# Altium schematic sheet Bridges.SchDoc
size A3
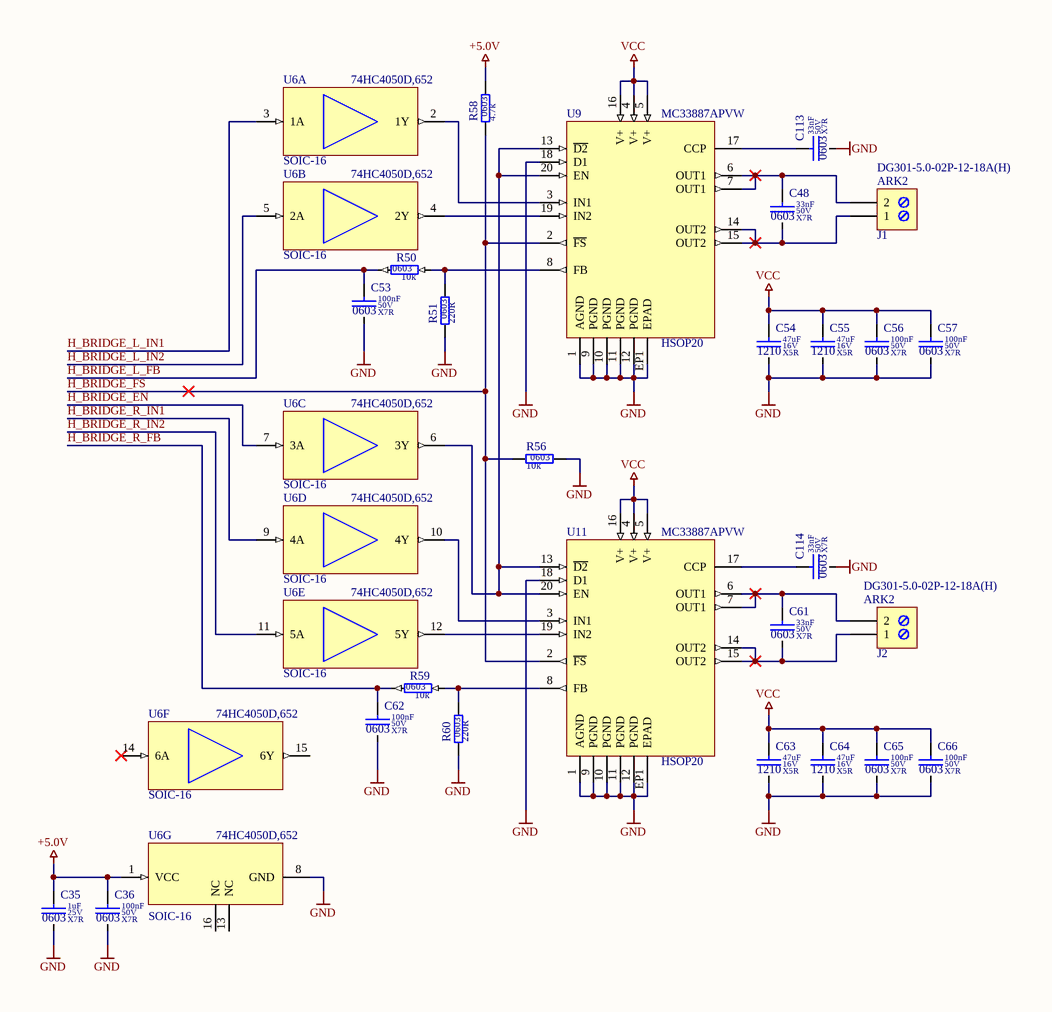
[diagram p0: Bridges.SchDoc]

## Parts
C35  value 1uF  Dielectric: X7R  Voltage: 25V  SCH_Footprint: 0603  [C_0603_1608]  (hidden comment: Ceramic X7R)
C36  value 100nF  Dielectric: X7R  Voltage: 50V  SCH_Footprint: 0603  [C_0603_1608]  (hidden comment: Ceramic X7R)
C48  value 33nF  Dielectric: X7R  Voltage: 50V  SCH_Footprint: 0603  [C_0603_1608]  (hidden comment: Ceramic X7R)
C53  value 100nF  Dielectric: X7R  Voltage: 50V  SCH_Footprint: 0603  [C_0603_1608]  (hidden comment: Ceramic X7R)
C54  value 47uF  Dielectric: X5R  Voltage: 16V  SCH_Footprint: 1210  [C_1210_3225]  (hidden comment: Ceramic X5R)
C55  value 47uF  Dielectric: X5R  Voltage: 16V  SCH_Footprint: 1210  [C_1210_3225]  (hidden comment: Ceramic X5R)
C56  value 100nF  Dielectric: X7R  Voltage: 50V  SCH_Footprint: 0603  [C_0603_1608]  (hidden comment: Ceramic X7R)
C57  value 100nF  Dielectric: X7R  Voltage: 50V  SCH_Footprint: 0603  [C_0603_1608]  (hidden comment: Ceramic X7R)
C61  value 33nF  Dielectric: X7R  Voltage: 50V  SCH_Footprint: 0603  [C_0603_1608]  (hidden comment: Ceramic X7R)
C62  value 100nF  Dielectric: X7R  Voltage: 50V  SCH_Footprint: 0603  [C_0603_1608]  (hidden comment: Ceramic X7R)
C63  value 47uF  Dielectric: X5R  Voltage: 16V  SCH_Footprint: 1210  [C_1210_3225]  (hidden comment: Ceramic X5R)
C64  value 47uF  Dielectric: X5R  Voltage: 16V  SCH_Footprint: 1210  [C_1210_3225]  (hidden comment: Ceramic X5R)
C65  value 100nF  Dielectric: X7R  Voltage: 50V  SCH_Footprint: 0603  [C_0603_1608]  (hidden comment: Ceramic X7R)
C66  value 100nF  Dielectric: X7R  Voltage: 50V  SCH_Footprint: 0603  [C_0603_1608]  (hidden comment: Ceramic X7R)
C113  value 33nF  Dielectric: X7R  Voltage: 50V  SCH_Footprint: 0603  [C_0603_1608]  (hidden comment: Ceramic X7R)
C114  value 33nF  Dielectric: X7R  Voltage: 50V  SCH_Footprint: 0603  [C_0603_1608]  (hidden comment: Ceramic X7R)
J1  value DG301-5.0-02P-12-18A(H)  [J_ARK2]  (hidden comment: ARK2)
J2  value DG301-5.0-02P-12-18A(H)  [J_ARK2]  (hidden comment: ARK2)
R50  value 10k  SCH_Footprint: 0603  [R_0603_1608]  (hidden comment: Resistor)
R51  value 220R  SCH_Footprint: 0603  [R_0603_1608]  (hidden comment: Resistor)
R56  value 10k  SCH_Footprint: 0603  [R_0603_1608]  (hidden comment: Resistor)
R58  value 4.7k  SCH_Footprint: 0603  [R_0603_1608]  (hidden comment: Resistor)
R59  value 10k  SCH_Footprint: 0603  [R_0603_1608]  (hidden comment: Resistor)
R60  value 220R  SCH_Footprint: 0603  [R_0603_1608]  (hidden comment: Resistor)
U6  SCH_Footprint: SOIC-16  [SOP16_SO16_SOIC16_4X10X18]  (hidden comment: 74HC4050D,652)  (parts A,B,C,D,E,F,G of 7)
U9  value MC33887APVW  SCH_Footprint: HSOP20  [HSOP20_16x11]  (hidden comment: MC33887)
U11  value MC33887APVW  SCH_Footprint: HSOP20  [HSOP20_16x11]  (hidden comment: MC33887)

## Nets
+5.0V: C35.1 C36.1 R58.2 U6.1(VCC)
GND: C35.2 C36.2 C53.2 C54.2 C55.2 C56.2 C57.2 C62.2 C63.2 C64.2 C65.2 C66.2 C113.2 C114.2 R51.1 R56.2 R60.1 U6.8(GND) U9.1(AGND) U9.9(PGND) U9.10(PGND) U9.11(PGND) U9.12(PGND) U9.18(D1) U9.EP1(EPAD) U11.1(AGND) U11.9(PGND) U11.10(PGND) U11.11(PGND) U11.12(PGND) U11.18(D1) U11.EP1(EPAD)
VCC: C54.1 C55.1 C56.1 C57.1 C63.1 C64.1 C65.1 C66.1 U9.4(V+) U9.5(V+) U9.16(V+) U11.4(V+) U11.5(V+) U11.16(V+)
H_BRIDGE_EN: U6.7(3A)
H_BRIDGE_FS: R56.1 R58.1 U9.2(~{FS}) U11.2(~{FS})
H_BRIDGE_L_FB: C53.1 R50.2
H_BRIDGE_L_IN1: U6.3(1A)
H_BRIDGE_L_IN2: U6.5(2A)
H_BRIDGE_R_FB: C62.1 R59.2
H_BRIDGE_R_IN1: U6.9(4A)
H_BRIDGE_R_IN2: U6.11(5A)
NetC48_1: C48.1 J1.2 U9.6(OUT1) U9.7(OUT1)
NetC48_2: C48.2 J1.1 U9.14(OUT2) U9.15(OUT2)
NetC61_1: C61.1 J2.2 U11.6(OUT1) U11.7(OUT1)
NetC61_2: C61.2 J2.1 U11.14(OUT2) U11.15(OUT2)
NetC113_1: C113.1 U9.17(CCP)
NetC114_1: C114.1 U11.17(CCP)
NetR50_1: R50.1 R51.2 U9.8(FB)
NetR59_1: R59.1 R60.2 U11.8(FB)
NetU6_2: U6.2(1Y) U9.3(IN1)
NetU6_4: U6.4(2Y) U9.19(IN2)
NetU6_6: U6.6(3Y) U9.13(~{D2}) U9.20(EN) U11.13(~{D2}) U11.20(EN)
NetU6_10: U6.10(4Y) U11.3(IN1)
NetU6_12: U6.12(5Y) U11.19(IN2)

Not connected (* = marked no-connect by the designer): U6 13(NC) 14(6A)* 15(6Y) 16(NC)

## Notes on the sheet
- Title
- Size:
- Date:
- A3
- Number:
- Time:
- Revision:
- Sheet
- of
- File:

## Library data of the parts
C35 = C_1uF_25V_X7R_0603_10: Capacitor; Manufacturer: Samsung; Manufacturer Part Number: CL10B105KA8NNNC; Tolerance (%): 10; Part Number: C_1uF_25V_X7R_0603_10; HelpURL: http://www.tme.eu/pl/Document/4a42202b32dab16128fe107dd69598cc/samsung-chip-cap.pdf; Supplier 1: TME; Supplier Part Number 1: CL10B105KA8NNNC; Supplier 2: RS Components; Supplier 3: Farnell; Supplier 4: Mouser; Supplier 5: Digi-Key
C36 C53 C56 C57 C62 C65 C66 = C_100nF_50V_X7R_0603_5: Capacitor; Manufacturer: Samsung; Manufacturer Part Number: CL10B104JB8NNNC; Tolerance (%): 5; Part Number: C_100nF_50V_X7R_0603_5; HelpURL: http://www.tme.eu/pl/Document/4a42202b32dab16128fe107dd69598cc/samsung-chip-cap.pdf; Supplier 1: TME; Supplier Part Number 1: CL10B104JB8NNNC; Supplier 2: RS Components; Supplier 3: Farnell; Supplier 4: Mouser; Supplier 5: Digi-Key
C48 C61 C113 C114 = C_33nF_50V_X7R_0603_10: Capacitor; Manufacturer: Yageo; Manufacturer Part Number: CC0603KRX7R9BB333; Tolerance (%): 10; Part Number: C_33nF_50V_X7R_0603_10; HelpURL: https://datasheet.octopart.com/CC0603KRX7R9BB333-Yageo-datasheet-10883670.pdf; Supplier 1: TME; Supplier 2: RS Components; Supplier 3: Farnell; Supplier 4: Mouser; Supplier 5: Digi-Key
C54 C55 C63 C64 = C_47uF_16V_X5R_1210_10: Capacitor; Manufacturer: Samsung; Manufacturer Part Number: CL32A476KOJNNNE; Tolerance (%): 10; Part Number: C_47uF_16V_X5R_1210_10; HelpURL: http://www.samsungsem.com/kr/support/product-search/mlcc/__icsFiles/afieldfile/2018/06/21/CL32A476KOJNNNE.pdf; Supplier 1: TME; Supplier 2: RS Components; Supplier 3: Farnell; Supplier 4: Mouser; Supplier 5: Digi-Key; Supplier Part Number 5: 1276-3376-1-ND
J1 J2 = J_TB-5.0-P-2P: ARK Screw terminal, 2-Pin; Manufacturer: DEGSON ELECTRONICS; SCH_Footprint: ARK2; Part Number: J_TB-5.0-P-2P; Component Type: Standard; HelpURL: https://datasheet.octopart.com/DG301-5.0-03P-12-18A%28H%29-Degson-datasheet-17801202.pdf; Manufacturer Part Number: DG301-5.0-02P-12-18A(H); Supplier 1: TME; Supplier Part Number 1: DG301-5.0-2/6B; Supplier 2: RS Components; Supplier 3: Farnell; Supplier 4: Mouser; Supplier 5: Digi-Key
R50 R56 R59 = R_10k_0603_1: Manufacturer: Vishay; Manufacturer Part Number: CRCW060310K0FKTABC; Voltage: 75V; Power: 100mW; Tolerance: 1%; Part Number: R_10k_0603_1; HelpURL: http://www.tme.eu/pl/Document/622e28308c06d160637f2b14751ba16b/Data%20Sheet%20CRCW_BCe3.pdf; Supplier 1: TME; Supplier Part Number 1: CRCW060310K0FKTABC; Supplier 2: RS Components; Supplier 3: Farnell; Supplier 4: Mouser; Supplier Part Number 4: 667-ERJ-3EKF1002V; Supplier 5: Digi-Key; Supplier Part Number 5: P10KGCT-ND
R51 R60 = R_220R_0603_1: Manufacturer: Royalohm; Manufacturer Part Number: 0603SAF2200T5E; Voltage: 50V; Power: 100mW; Tolerance: 1%; Part Number: R_220R_0603_1; HelpURL: http://www.tme.eu/pl/Document/b315665a56acbc42df513c99b390ad98/ROYALOHM-THICKFILM.pdf; Supplier 1: TME; Supplier Part Number 1: SMD0603-220R-1%; Supplier 2: RS Components; Supplier 3: Farnell; Supplier 4: Mouser; Supplier 5: Digi-Key
R58 = R_4.7k_0603_1: Manufacturer: Yageo; Manufacturer Part Number: RC0603FR-074K7L; Voltage: 75V; Power: 100mW; Tolerance: 1%; Part Number: R_4.7k_0603_1; HelpURL: http://www.farnell.com/datasheets/2167052.pdf?_ga=2.156163131.1690599162.1548417389-1379097396.1542296996&_gac=1.18389067.1547230258.Cj0KCQiAmuHhBRD0ARIsAFWyPwhX8HcvXnM3tA0ZBodZLzDIjH2ZxLpjT5LWo9bad_HPRbU8LfPq44UaAhEwEALw_wcB; Supplier 1: TME; Supplier Part Number 1: RC0603FR-074K7; Supplier 2: RS Components; Supplier 3: Farnell; Supplier Part Number 3: 9238565; Supplier 4: Mouser; Supplier Part Number 4: 603-RC0603FR-074K7L; Supplier 5: Digi-Key; Supplier Part Number 5: 311-4.70KHRCT-ND
U6 = U_74HC4050D,652: Manufacturer: Nexperia; Value: 74HC4050D,652; Part Number: U_74HC4050D,652; HelpURL: https://datasheet.octopart.com/74HC4050D%2C652-Nexperia-datasheet-77871310.pdf; Manufacturer Part Number: 74HC4050D,652; Supplier 1: TME; Supplier Part Number 1: 74HC4050D.652; Supplier 2: RS Components; Supplier Part Number 2: 1035684; Supplier 3: Farnell; Supplier Part Number 3: 1085272; Supplier 4: Mouser; Supplier Part Number 4: 771-HC4050D652; Supplier 5: Digi-Key; Supplier Part Number 5: 1727-2806-ND
U9 U11 = U_MC33887_HSOP20: Manufacturer: NXP; Part Number: U_MC33887_HSOP20; HelpURL: https://datasheet.octopart.com/MC33887APVW-NXP-Semiconductors-datasheet-12522992.pdf; Manufacturer Part Number: MC33887APVW; Supplier 1: TME; Supplier Part Number 1: MC33887APVW; Supplier 2: RS Components; Supplier 3: Farnell; Supplier Part Number 3: 2308043; Supplier 4: Mouser; Supplier Part Number 4: 841-MC33887APVW; Supplier 5: Digi-Key; Supplier Part Number 5: MC33887APVW-ND